# Altium schematic sheet BMI160.SchDoc
size A
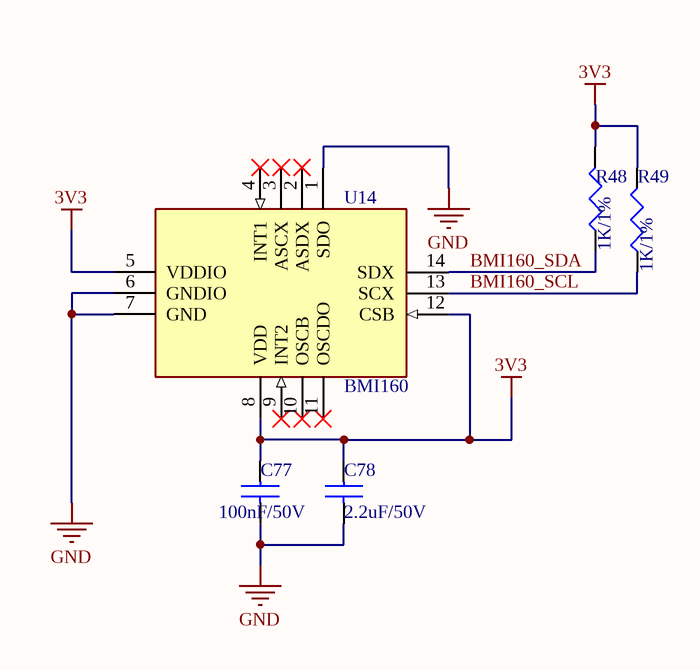
[diagram p0: BMI160.SchDoc]

## Parts
C77  100nF/50V  [C0402]
C78  2.2uF/50V  [C0402]
R48  1K/1%  [R0402]
R49  1K/1%  [R0402]
U14  BMI160  [PQFN50P300X250X88-14N]

## Nets
3V3: C77.1 C78.1 R48.2 R49.2 U14.5(VDDIO) U14.8(VDD) U14.12(CSB)
GND: C77.2 C78.2 U14.1(SDO) U14.6(GNDIO) U14.7(GND)
BMI160_SCL: R49.1 U14.13(SCX)
BMI160_SDA: R48.1 U14.14(SDX)

Not connected (* = marked no-connect by the designer): U14 2(ASDX)* 3(ASCX)* 4(INT1)* 9(INT2)* 10(OSCB)* 11(OSCDO)*

## Library data of the parts
C77 C78 = CAP NP: PCB Footprint: C0402
R48 R49 = RESISTOR: PCB Footprint: R0402
U14 = BMI160: Integrated Circuit; Manufacturer_Name: BOSCH; Datasheet Link: https://datasheet.datasheetarchive.com/originals/distributors/DKDS41/DSANUWW0031095.pdf; Height: 0.88mm; Manufacturer_Part_Number: BMI160; Mouser Part Number: 262-BMI160; Mouser Price/Stock: https://www.mouser.co.uk/ProductDetail/Bosch-Sensortec/BMI160?qs=Lj1LZLjqIN1DEsUDgjehlg%3D%3D; Arrow Part Number: BMI160; Arrow Price/Stock: https://www.arrow.com/en/products/bmi160/bosch?region=nac